# EAGLE design USBPowerWallSocket (EAGLE 7.4.0)
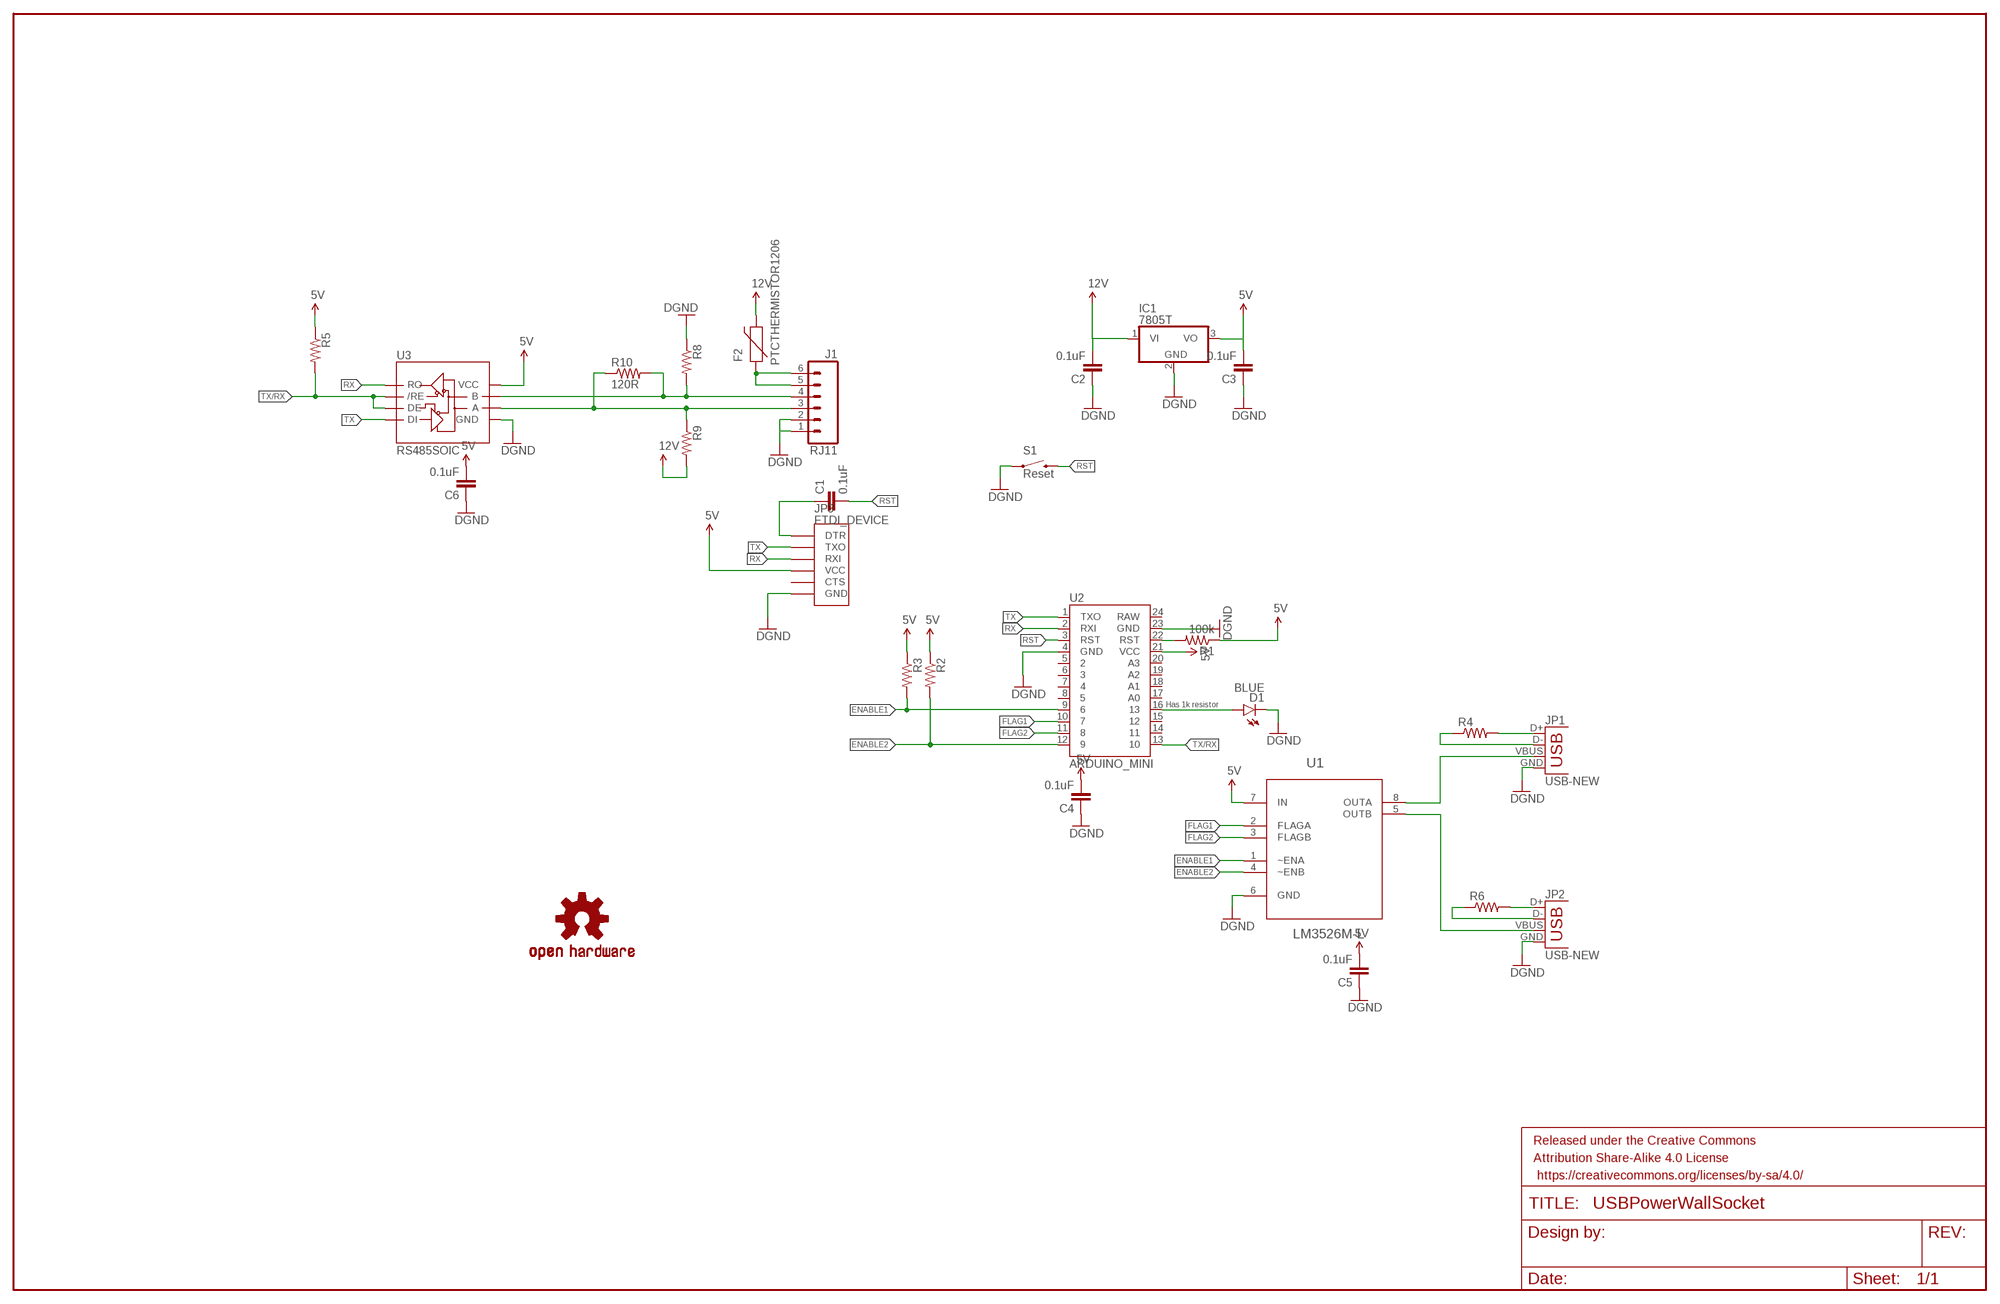
[diagram p0: schematic, sheet 1]

## Parts
C1  0.1uF  CAP0805  [0805]
C2  0.1uF  CAP0805  [0805]
C3  0.1uF  CAP0805  [0805]
C4  0.1uF  CAP0805  [0805]
C5  0.1uF  CAP0805  [0805]
C6  0.1uF  CAP0805  [0805]
D1  BLUE  LED-BLUE1206  [LED-1206]
F2  PTCTHERMISTOR1206  [PTC-1206]
FRAME1  FRAME-LEDGER  [CREATIVE_COMMONS]
IC1  7805T  [TO220H]
J1  RJ11  RJ11-6PTH  [RJ11-6]
JP1  USB-NEW  [USB-A-VERTICAL]
JP2  USB-NEW  [USB-A-VERTICAL]
JP3  FTDI_DEVICE  [FTDI_DEVICE_SIDE]
LOGO1  OSHW-LOGOM  [OSHW-LOGO-M]
R1  100k  RESISTOR0805-RES  [0805]
R2  RESISTOR0805-RES  [0805]
R3  RESISTOR0805-RES  [0805]
R4  RESISTOR0805-RES  [0805]
R5  RESISTOR0805-RES  [0805]
R6  RESISTOR0805-RES  [0805]
R8  RESISTOR0805-RES  [0805]
R9  RESISTOR0805-RES  [0805]
R10  120R  RESISTOR0805-RES  [0805]
S1  Reset  SWITCH-MOMENTARY-2PTH  [TACTILE-PTH]
U1  LM3526M-L  [SOIC127P640X175-8N]
U2  ARDUINO_MINI  [ARDUINO_MINI]
U3  RS485SOIC  [SO08]

## Nets
5V: C3.2 C4.2 C5.2 C6.2 IC1.3(VO) JP3.P$4(VCC) R1.1 R2.1 R3.1 R5.1 U1.7(IN) U2.21(VCC) U3.8(VCC)
12V: C2.2 F2.2 IC1.1(VI) R9.2
A: J1.3 R9.1 R10.1 U3.6(A)
B: J1.4 R8.2 R10.2 U3.7(B)
ENABLE1: R3.2 U1.1(~ENA) U2.9
ENABLE2: R2.2 U1.4(~ENB) U2.12
FLAG1: U1.2(FLAGA) U2.10
FLAG2: U1.3(FLAGB) U2.11
GND: C2.1 C3.1 C4.1 C5.1 C6.1 D1.C IC1.2(GND) J1.1 J1.2 JP1.GND JP2.GND JP3.P$6(GND) R8.1 S1.1 U1.6(GND) U2.4(GND) U2.23(GND) U3.5(GND) ; supply symbol labelled DGND
N$1: JP2.D- R6.1
N$2: D1.A U2.16
N$3: JP2.D+ R6.2
N$4: JP1.D- R4.1
N$5: JP1.D+ R4.2
N$6: F2.1 J1.5 J1.6
N$7: JP1.VBUS U1.8(OUTA)
N$8: JP2.VBUS U1.5(OUTB)
N$10: C1.1 JP3.P$1(DTR)
RST: C1.2 S1.3 U2.3(RST)
RST2: R1.2 U2.22(RST)
RX: JP3.P$3(RXI) U2.2(RXI) U3.1(RO)
TX: JP3.P$2(TXO) U2.1(TXO) U3.4(DI)
TX/RX: R5.2 U2.13 U3.2(/RE) U3.3(DE)
Unconnected: JP3.P$5(CTS) U2.5 U2.6 U2.7 U2.8 U2.14 U2.15 U2.17(A0) U2.18(A1) U2.19(A2) U2.20(A3) U2.24(RAW)

## Notes on the sheet
- Has 1k resistor

## Library data of the parts
C1-C6 = SparkFun-Passives:CAP: Capacitor Standard 0603 ceramic capacitor, and 0.1" leaded capacitor.
D1 = SparkFun-LED:LED-BLUE: Blue LEDs for production use Various blue LEDs stocked by SparkFun production 0603 - DIO-08575 Rebel - DIO-09553 1206 - DIO-09911; PROD_ID: DIO-09911
F2 = SparkFun-PowerIC:PTC: Resettable Fuse PTC Resettable Fuse. Spark Fun Electronics SKU : COM-08357; PROD_ID: RES-08585
FRAME1 = SparkFun-Aesthetics:FRAME-LEDGER: Schematic Frame Standard 11x14 US Ledger frame
IC1 = linear:78*: Positive VOLTAGE REGULATOR Source: http://cache.national.com/ds/LM/LM78L05.pdf http://www.fairchildsemi.com/ds/LM/LM7805.pdf
J1 = SparkFun-Connectors:RJ11-6: RJ11 Jack Simple 6 pin RJ11 jack. Commonly found on CAT3 devices and Microchip programmers. SKU: PRT-00132; PROD_ID: CONN-08590
JP1 JP2 = Tinamous:USB-NEW: USB Connectors USB-B-PTH is fully proven SKU : PRT-00139/CONN-08278 USB-miniB is fully proven SKU : PRT-00587 USB-A-PCB is untested. USB-A-H is throughly reviewed, but untested. Spark Fun Electronics SKU : PRT-00437 USB-B-SMT is throughly reviewed, but untested. Needs silkscreen touching up. USB-A-S has not been used/tested USB-MB-H has not been used/tested USB-MICROB has been used. CONN-09505
JP3 = SparkFun-Connectors:FTDI_DEVICE: Connector which mates to FTDI basic or FTDI cable.
LOGO1 = SparkFun-Aesthetics:OSHW-LOGO: Open Source Hardware Logo This logo indicates the piece of hardware it is found on incorporates a OSHW license and/or adheres to the definition of open source hardware found here: http://freedomdefined.org/OSHW
R1-R6 R8-R10 = SparkFun-Resistors:RESISTOR: Resistor Basic schematic elements and footprints for 0603, 1206, and PTH resistors.
S1 = SparkFun-Electromechanical:SWITCH-MOMENTARY-2: Various NO switches- pushbuttons, reed, etc; PROD_ID: SWCH-08441
U1 = LM3256M-L:LM3526M-L: Dual Port USB Power Switch; MPN: LM3526M-L; OC_FARNELL: 1469238; OC_NEWARK: 41K4868; PACKAGE: SOIC-8; SUPPLIER: National Semiconductor
U2 = SparkFun-Boards:ARDUINO_MINI: Arduino Pro Mini footprint
U3 = SparkFun-DigitalIC:RS485: RS485 transceiver

## Board
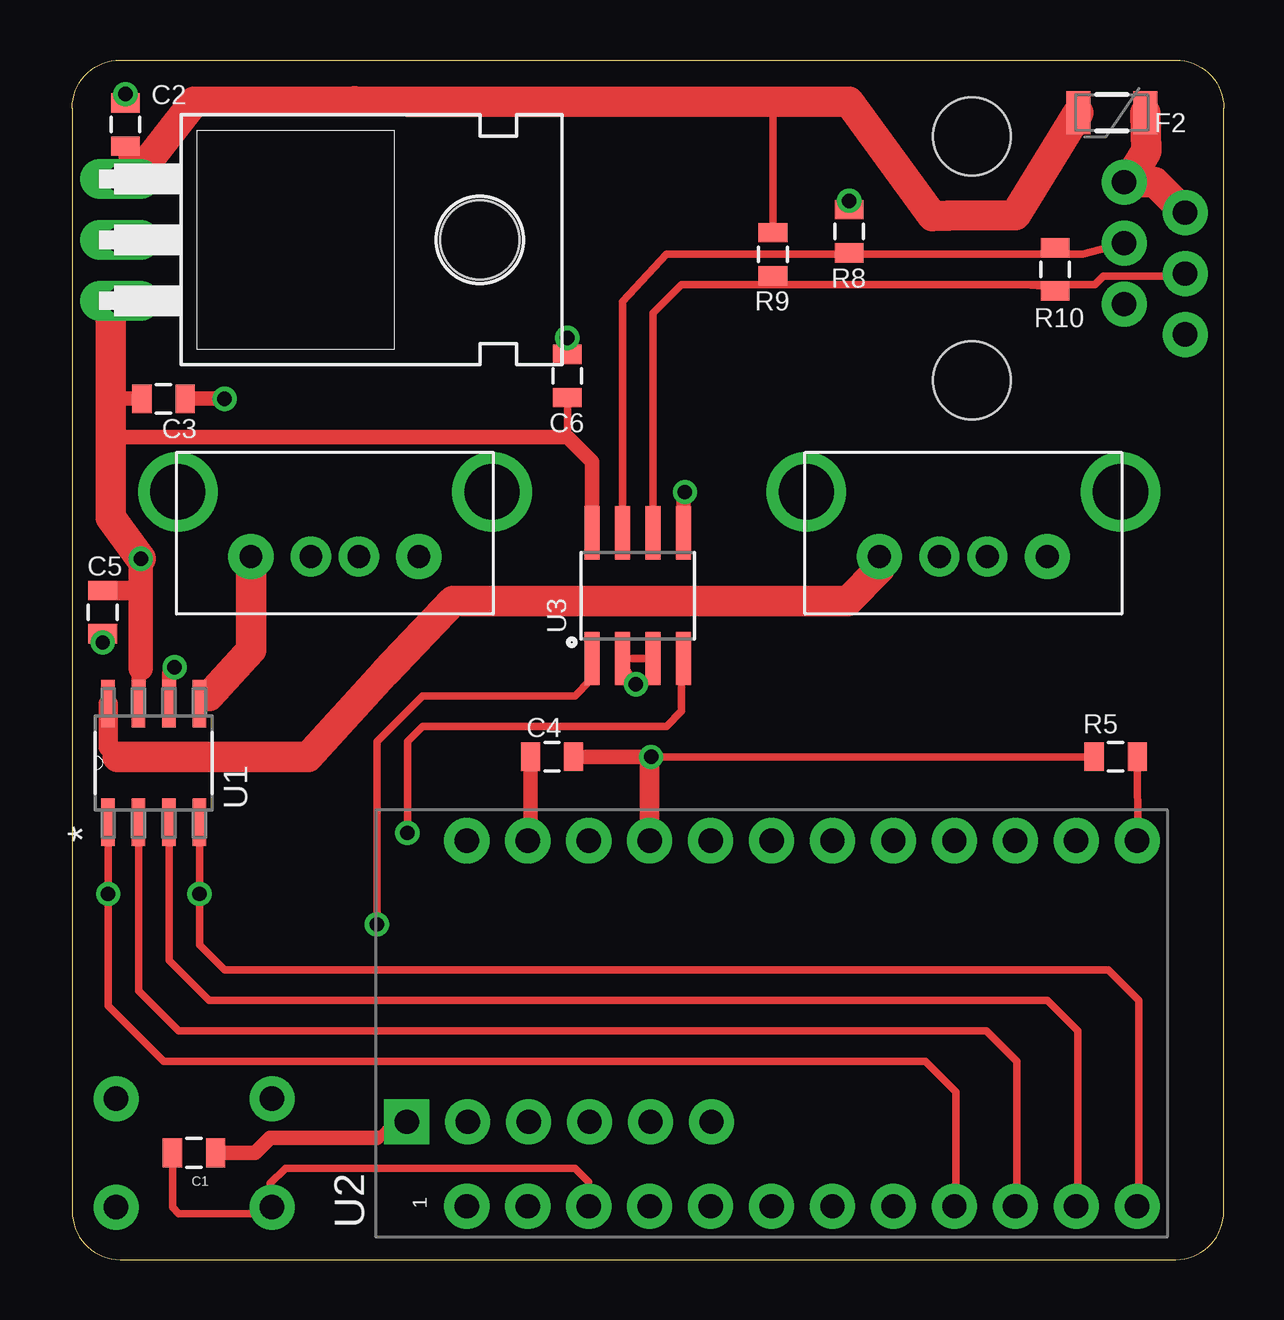
[diagram p1: board, top side]
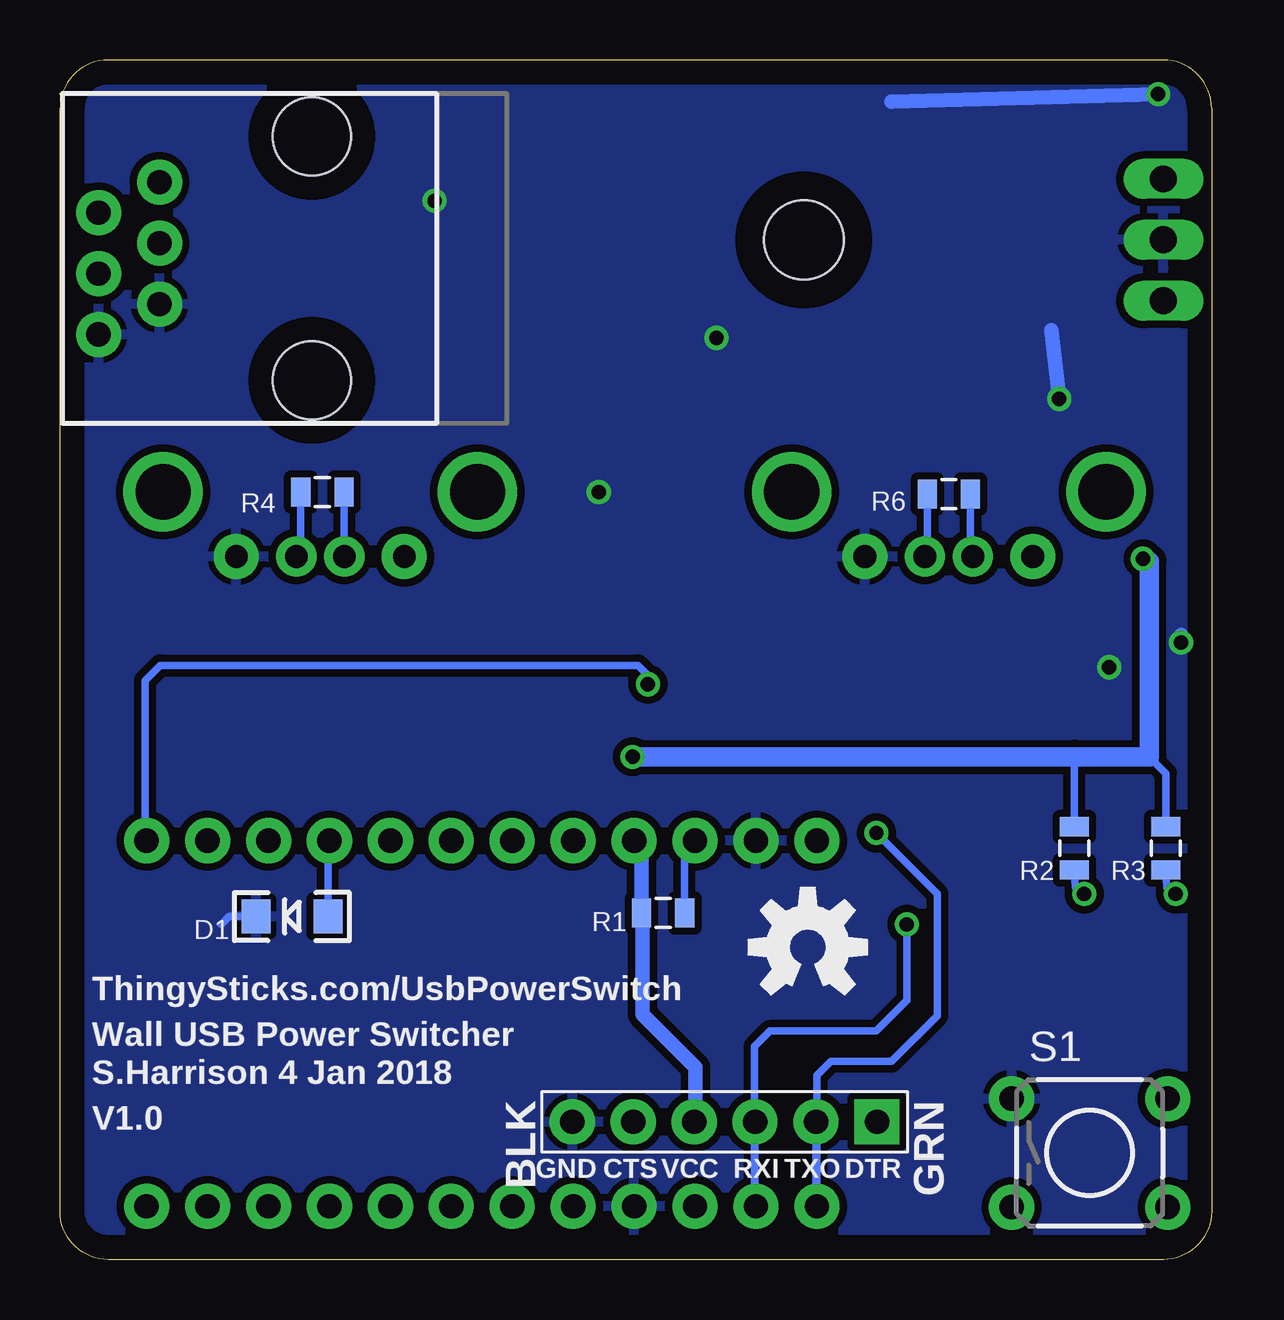
[diagram p2: board, bottom side, seen from below]

Size 48 x 50 mm. Coordinates in mm from the lower left corner, seen from the top.
Outline: 2,0 46,0 arc90 48,2 48,48 arc90 46,50 2,50 arc90 0,48 0,2 arc90 2,0
Copper layers (1*16): Top 0.035mm / dielectric 1.5mm / Bottom 0.035mm
Design rules "default": minimum track width 10mil, minimum drill 24mil, track to track 8mil, track to pad 8mil, pad to pad 8mil, via to via 8mil, smd to smd 8mil, copper to edge 40mil, drill to drill 8mil, minimum pad ring 10mil, minimum via ring 8mil, stop-mask expansion 4mil, vias tented up to drill 0mil, thermal gap 10mil
bKeepout: area 5.1,34.9 to 29.8,48.3

### Footprints (pad centres in the part's own frame; a part is rotated, then mirrored left to right if it is on the bottom)
0805 = smd 0.8 x 1.2: 1 -0.9,0; 2 0.9,0
LED-1206 = smd 1.2 x 1.4: A -1.5,0; C 1.5,0
PTC-1206 = smd 1 x 1.8: 1 -1.4,0; 2 1.4,0
TO220H = drill 1.118 long: 1 -2.54,-10.16; 2 0,-10.16; 3 2.54,-10.16 | hole 3.302: 0,4.826
RJ11-6 = drill 1.016 pad 1.88: 1 -3.175,8.89; 2 -1.905,6.35; 3 -0.635,8.89; 4 0.635,6.35; 5 1.905,8.89; 6 3.175,6.35 | hole 3.251: -5.08,0; 5.08,0
USB-A-VERTICAL = drill 0.95 pad 1.676: D+ 2.7,1; D- 2.7,-1 | drill 0.95 pad 1.88: GND 2.7,3.5; VBUS 2.7,-3.5 | drill 2.3: SHLD1 0,-6.55; SHLD2 0,6.55
FTDI_DEVICE_SIDE = drill 1.016 pad 1.88 square: P$1 -6.35,0 | drill 1.016 pad 1.88: P$2 -3.81,0; P$3 -1.27,0; P$4 1.27,0; P$5 3.81,0; P$6 6.35,0
TACTILE-PTH = drill 1.016 pad 1.88: 1 -3.251,2.261; 2 3.251,2.261; 3 -3.251,-2.261; 4 3.251,-2.261
SOIC127P640X175-8N = smd 1.981 x 0.559: 1 -2.464,1.905; 2 -2.464,0.635; 3 -2.464,-0.635; 4 -2.464,-1.905; 5 2.464,-1.905; 6 2.464,-0.635; 7 2.464,0.635; 8 2.464,1.905
ARDUINO_MINI = drill 1.016 pad 1.88: 1 -7.62,12.7; 2 -7.62,10.16; 3 -7.62,7.62; 4 -7.62,5.08; 5 -7.62,2.54; 6 -7.62,0; 7 -7.62,-2.54; 8 -7.62,-5.08; 9 -7.62,-7.62; 10 -7.62,-10.16; 11 -7.62,-12.7; 12 -7.62,-15.24; 13 7.62,-15.24; 14 7.62,-12.7; 15 7.62,-10.16; 16 7.62,-7.62; 17 7.62,-5.08; 18 7.62,-2.54; 19 7.62,0; 20 7.62,2.54; 21 7.62,5.08; 22 7.62,7.62; 23 7.62,10.16; 24 7.62,12.7
SO08 = smd 0.61 x 2.21: 1 -1.905,-2.616; 2 -0.635,-2.616; 3 0.635,-2.616; 4 1.905,-2.616; 5 1.905,2.616; 6 0.635,2.616; 7 -0.635,2.616; 8 -1.905,2.616

### Placement (x,y rotation side)
C1  5.08,4.45 180 top
C2  2.22,47.31 270 top
C3  3.81,35.88 180 top
C4  20,20.95 0 top
C5  1.27,26.99 90 top
C6  20.64,36.83 270 top
D1  38.33,14.3 180 bottom
F2  43.33,47.8 180 top
FRAME1  -5.4,-8.89 0 top  (outside the outline)
IC1  12.16,42.5 270 top
J1  37.5,41.73 90 bottom
JP1  37.15,32 270 top
JP2  10.95,32 270 top
JP3  20.29,5.74 180 bottom
LOGO1  16.83,13.02 0 bottom
R1  22.86,14.45 0 bottom
R2  5.71,17.14 270 bottom
R3  1.91,17.14 270 bottom
R4  37.06,31.99 180 bottom
R5  43.5,20.95 0 top
R6  10.95,31.9 180 bottom
R8  32.38,42.86 270 top
R9  29.21,41.9 90 top
R10  40.97,41.27 90 top
S1  5.08,4.45 0 bottom
U1  3.4,20.7 90 top
U2  29.15,9.84 90 top
U3  23.57,27.68 0 top

### Tracks (layer width: path | path; a pad name or v marks a point on that pad's centre or on a via)
5V  (via drill 0.6)
  Top 0.305: R5.1 42.48,20.94 41.27,20.95 v24.13,20.95 | C6.2 20.64,34.29
  Top 0.61: 2.86,24.64 2.77,25.4 U1.7 | U3.8 21.67,33.26 20.64,34.29 1.91,34.29 1.59,34.61 1.92,35.56 1.6,33.97 | C4.2 v24.13,20.95 | C3.2 1.6,35.88
  Top 0.813: U2.21 24.07,20.89 v24.13,20.95 | C5.2 2.81,27.89 2.86,27.94
  Top 1.016: v2.86,29.21 2.86,27.94 2.86,24.64
  Top 1.27: IC1.3 1.6,39.37 1.6,35.88 1.6,33.97 1.6,30.94 v2.86,29.21
  Bottom 0.305: 21.51,5.79 JP3.P$4 21.59,5.71 | R3.1 1.91,20.27 2.59,20.95 | R2.1 5.71,20.95
  Bottom 0.61: 21.51,5.79 21.51,8 23.72,10.21 23.72,14.42 R1.1 23.76,17.15 U2.21
  Bottom 0.813: v24.13,20.95 5.71,20.95 2.59,20.95 2.59,29.1 v2.86,29.21
12V
  Top 0.305: R9.2 29.21,48.26
  Top 0.61: C2.2 2.22,45.04
  Top 1.27: IC1.1 2.22,45.04 2.58,45.04 5.08,48.26 11.77,48.28 14,48.26 29.21,48.26 32.38,48.26 35.87,43.48 36.51,43.51 39.32,43.53 F2.2
A
  Top 0.305: U3.6 24.21,39.45 25.4,40.64 29.21,40.64 | 29.21,40.64 39.69,40.64 | 39.69,40.64 42.62,40.64 42.98,41 46.29,41 J1.3 | R10.1 40.98,40.53 39.69,40.64 | R9.1 29.21,40.64
B
  Top 0.305: U3.7 22.94,39.93 24.77,41.91 32.38,41.91 | 32.38,41.91 40.96,41.91 | 40.96,41.91 42.12,41.91 J1.4 | R8.2 32.38,41.91 | R10.2 40.96,41.91
ENABLE1  (via drill 0.6)
  Top 0.305: U2.9 36.83,2.28 36.83,6.99 35.56,8.26 3.81,8.26 1.5,10.57 v1.5,15.24 U1.1
  Bottom 0.305: R3.2 1.86,15.51 v1.5,15.24
ENABLE2  (via drill 0.6)
  Top 0.305: U2.12 44.45,2.28 44.45,10.79 43.18,12.06 6.35,12.06 5.3,13.11 v5.3,15.24 U1.4
  Bottom 0.305: R2.2 5.67,15.51 v5.3,15.24
FLAG1
  Top 0.305: U1.2 2.77,11.21 4.45,9.53 38.1,9.53 39.37,8.26 39.37,2.28 U2.10
FLAG2
  Top 0.305: U1.3 4.04,12.47 5.71,10.79 40.64,10.79 41.91,9.53 41.91,2.28 U2.11
GND  (via drill 0.6)
  Top 0.305: R8.1 v32.38,44.13
  Top 0.61: U1.6 4.04,24.46 v4.27,24.69 | U3.5 25.48,31.93 v25.54,31.99 | C6.1 v20.64,38.42 | C4.1 19.1,17.57 U2.23 | C5.1 v1.27,25.72 | C2.1 v2.22,48.58 | C3.1 v6.35,35.88
  Bottom 0.305: D1.C 40.95,14.3 41.27,13.97 | v32.38,44.13 32.38,44.45
  Bottom 0.61: 14.54,29.21 JP2.GND | v1.27,25.72 1.27,26.04 | v2.22,48.58 13.34,48.26 | v6.35,35.88 6.67,38.73
  pour Bottom (isolate 0.305): -0.4,62.4 48.6,62.4 48.6,-0.9 -0.6,-0.9 -0.6,62.5
N$1
  Bottom 0.305: R6.1 10.05,29.2 JP2.D-
N$2
  Bottom 0.305: D1.A 36.83,17.4 U2.16
N$3
  Bottom 0.305: R6.2 11.85,29.2 JP2.D+
N$4
  Bottom 0.305: R4.1 JP1.D-
N$5
  Bottom 0.305: R4.2 37.96,29.43 JP1.D+
N$6
  Top 1.27: 46.35,43.67 J1.5 45.12,44.91 J1.6 43.67,45.09 44.3,45.41 44.78,46.2 F2.1
N$7
  Top 0.813: U1.8 1.5,21.36 1.91,20.95
  Top 1.27: 1.91,20.95 9.84,20.95 13.02,24.45 15.88,27.46 32.33,27.46 33.66,28.78 JP1.VBUS
N$8
  Top 0.61: U1.5 5.71,23.16 5.71,23.5
  Top 1.27: 5.71,23.5 7.45,25.4 JP2.VBUS
N$10
  Top 0.305: JP3.P$1 13.36,5.74 12.7,5.08
  Top 0.61: C1.1 7.62,4.45 8.26,5.08 12.7,5.08
RST
  Top 0.305: U2.3 21.53,3.23 20.95,3.81 8.89,3.81 8.26,3.17 8.26,2.26 S1.3 8.05,1.91 4.45,1.91 4.18,2.17 C1.2
RST2
  Bottom 0.305: R1.2 21.96,17.03 U2.22
RX  (via drill 0.6)
  Top 0.305: 21.51,25.02 21.51,25.06 U3.1 21.59,24.98 21.59,24.13 20.95,23.5 14.61,23.5 12.7,21.59 v12.7,13.97
  Bottom 0.305: v12.7,13.97 12.7,10.79 13.97,9.53 18.41,9.53 19.05,8.89 19.05,2.28 U2.2 | 18.97,2.24 U2.2 | JP3.P$3 19.02,2.25 U2.2
TX  (via drill 0.6)
  Top 0.305: U3.4 25.4,24.98 25.4,22.86 24.77,22.23 14.61,22.23 13.97,21.59 v13.97,17.78
  Bottom 0.305: U2.1 16.45,7.68 15.88,8.26 13.34,8.26 11.43,10.16 11.43,15.24 v13.97,17.78 | 16.43,2.24 U2.1 | JP3.P$2 16.48,2.25 U2.1
TX/RX  (via drill 0.6)
  Top 0.305: v23.5,23.98 22.86,24.98 U3.2 U3.3 | R5.2 44.42,17.5 U2.13
  Bottom 0.305: v23.5,23.98 23.57,24.21 23.57,24.42 23.92,24.77 43.81,24.77 44.45,24.13 44.45,17.14 44.39,17.2 U2.13

### Text on the board
tNames: 1
bNames: ThingySticks.com/UsbPowerSwitch | Wall USB Power Switcher | S.Harrison 4 Jan 2018 | V1.0
tDocu: RJ11 sockets mounted on the underneath / (i.e. between PCB and box back), / others top side mounted (between PCB and face plate).